# Altium schematic sheet 05_08_4bit_Ripple_Carry_Full_Adder.SchDoc
size 81 x 101 mm
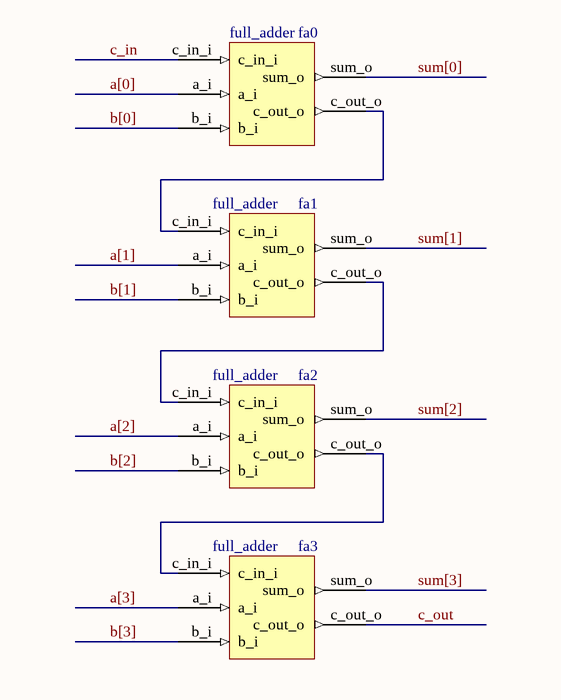
[diagram p0: 05_08_4bit_Ripple_Carry_Full_Adder.SchDoc]

## Parts
fa0  full_adder
fa1  full_adder
fa2  full_adder
fa3  full_adder

## Nets
a[0]: fa0.a_i
a[1]: fa1.a_i
a[2]: fa2.a_i
a[3]: fa3.a_i
b[0]: fa0.b_i
b[1]: fa1.b_i
b[2]: fa2.b_i
b[3]: fa3.b_i
c_in: fa0.c_in_i
c_out: fa3.c_out_o
sum[0]: fa0.sum_o
sum[1]: fa1.sum_o
sum[2]: fa2.sum_o
sum[3]: fa3.sum_o
Netfa0_c_out_o: fa0.c_out_o fa1.c_in_i
Netfa1_c_out_o: fa1.c_out_o fa2.c_in_i
Netfa2_c_out_o: fa2.c_out_o fa3.c_in_i